# EAGLE schematic axiom_beta_sensor_cmv12000_v0.14_tht.d1d1087f (EAGLE 7.7.0)

## Sheet 1 of 4
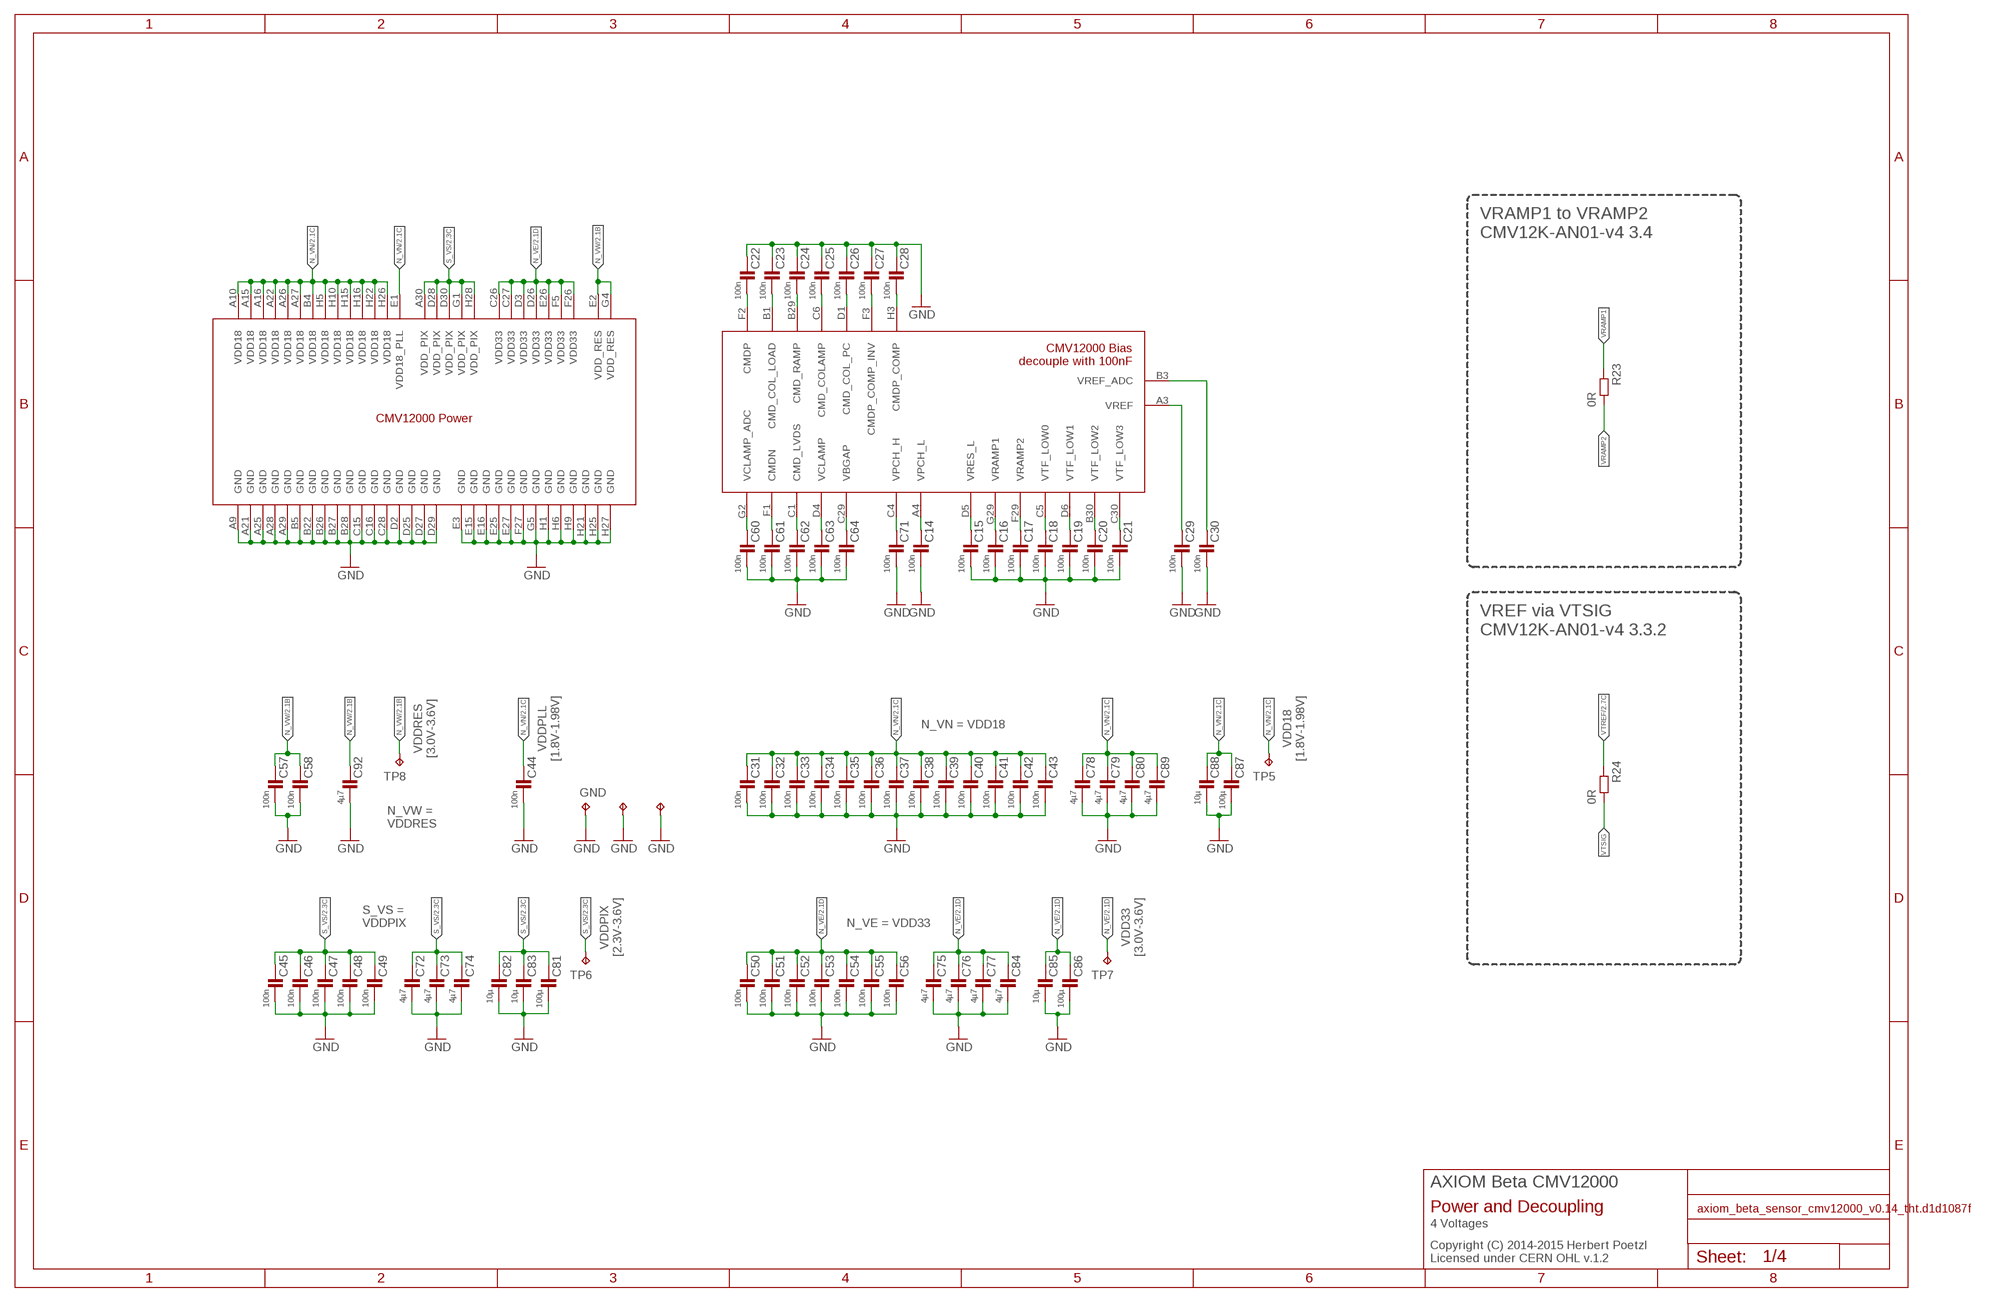
[diagram p0: schematic, sheet 1]

### Parts
C14  100n  C0402-C  [0402-C]
C15  100n  C0402-C  [0402-C]
C16  100n  C0402-C  [0402-C]
C17  100n  C0402-C  [0402-C]
C18  100n  C0402-C  [0402-C]
C19  100n  C0402-C  [0402-C]
C20  100n  C0402-C  [0402-C]
C21  100n  C0402-C  [0402-C]
C22  100n  C0402-C  [0402-C]
C23  100n  C0402-C  [0402-C]
C24  100n  C0402-C  [0402-C]
C25  100n  C0402-C  [0402-C]
C26  100n  C0402-C  [0402-C]
C27  100n  C0402-C  [0402-C]
C28  100n  C0402-C  [0402-C]
C29  100n  C0402-C  [0402-C]
C30  100n  C0402-C  [0402-C]
C31  100n  C0402-C  [0402-C]
C32  100n  C0402-C  [0402-C]
C33  100n  C0402-C  [0402-C]
C34  100n  C0402-C  [0402-C]
C35  100n  C0402-C  [0402-C]
C36  100n  C0402-C  [0402-C]
C37  100n  C0402-C  [0402-C]
C38  100n  C0402-C  [0402-C]
C39  100n  C0402-C  [0402-C]
C40  100n  C0402-C  [0402-C]
C41  100n  C0402-C  [0402-C]
C42  100n  C0402-C  [0402-C]
C43  100n  C0402-C  [0402-C]
C44  100n  C0402-C  [0402-C]
C45  100n  C0402-C  [0402-C]
C46  100n  C0402-C  [0402-C]
C47  100n  C0402-C  [0402-C]
C48  100n  C0402-C  [0402-C]
C49  100n  C0402-C  [0402-C]
C50  100n  C0402-C  [0402-C]
C51  100n  C0402-C  [0402-C]
C52  100n  C0402-C  [0402-C]
C53  100n  C0402-C  [0402-C]
C54  100n  C0402-C  [0402-C]
C55  100n  C0402-C  [0402-C]
C56  100n  C0402-C  [0402-C]
C57  100n  C0402-C  [0402-C]
C58  100n  C0402-C  [0402-C]
C60  100n  C0402-C  [0402-C]
C61  100n  C0402-C  [0402-C]
C62  100n  C0402-C  [0402-C]
C63  100n  C0402-C  [0402-C]
C64  100n  C0402-C  [0402-C]
C71  100n  C0402-C  [0402-C]
C72  4µ7  C0402-B  [0402-B]
C73  4µ7  C0402-C  [0402-C]
C74  4µ7  C0402-C  [0402-C]
C75  4µ7  C0402-C  [0402-C]
C76  4µ7  C0402-C  [0402-C]
C77  4µ7  C0402-B  [0402-B]
C78  4µ7  C0402-B  [0402-B]
C79  4µ7  C0402-C  [0402-C]
C80  4µ7  C0402-C  [0402-C]
C81  100µ  C1206-B  [1206-B]
C82  10µ  C0603-C  [0603-C]
C83  10µ  C0603-C  [0603-C]
C84  4µ7  C0402-C  [0402-C]
C85  10µ  C0603-C  [0603-C]
C86  100µ  C1206-B  [1206-B]
C87  100µ  C1206-B  [1206-B]
C88  10µ  C0603-C  [0603-C]
C89  4µ7  C0402-C  [0402-C]
C92  4µ7  C0402-C  [0402-C]
GND  TPTP10R  [TP10R]
GND75  TPTP10R  [TP10R]
GND77  TPTP10R  [TP10R]
R23  0R  R0402-C  [0402-C]
R24  0R  R0402-C  [0402-C]
SENSOR  CMV12000ANDON  [10-30-07-237-400T4]
TP5  TPTP10R  [TP10R]
TP6  TPTP10R  [TP10R]
TP7  TPTP10R  [TP10R]
TP8  TPTP10R  [TP10R]

### Nets
GND: C14.2 C15.2 C16.2 C17.2 C18.2 C19.2 C20.2 C21.2 C22.1 C23.1 C24.1 C25.1 C26.1 C27.1 C28.1 C29.2 C30.2 C31.2 C32.2 C33.2 C34.2 C35.2 C36.2 C37.2 C38.2 C39.2 C40.2 C41.2 C42.2 C43.2 C44.2 C45.2 C46.2 C47.2 C48.2 C49.2 C50.2 C51.2 C52.2 C53.2 C54.2 C55.2 C56.2 C57.2 C58.2 C60.2 C61.2 C62.2 C63.2 C64.2 C71.2 C72.2 C73.2 C74.2 C75.2 C76.2 C77.2 C78.2 C79.2 C80.2 C81.2 C82.2 C83.2 C84.2 C85.2 C86.2 C87.2 C88.2 C89.2 C92.2 GND75.TP GND77.TP GND.TP SENSOR.A9(GND) SENSOR.A21(GND) SENSOR.A25(GND) SENSOR.A28(GND) SENSOR.A29(GND) SENSOR.B5(GND) SENSOR.B22(GND) SENSOR.B26(GND) SENSOR.B27(GND) SENSOR.B28(GND) SENSOR.C15(GND) SENSOR.C16(GND) SENSOR.C28(GND) SENSOR.D2(GND) SENSOR.D25(GND) SENSOR.D27(GND) SENSOR.D29(GND) SENSOR.E3(GND) SENSOR.E15(GND) SENSOR.E16(GND) SENSOR.E25(GND) SENSOR.E27(GND) SENSOR.F27(GND) SENSOR.G5(GND) SENSOR.H1(GND) SENSOR.H6(GND) SENSOR.H9(GND) SENSOR.H21(GND) SENSOR.H25(GND) SENSOR.H27(GND) ; also sheet 2,3,4
N$5: C60.1 SENSOR.G2(VCLAMP_ADC)
N$6: C61.1 SENSOR.F1(CMDN)
N$11: C62.1 SENSOR.C1(CMD_LVDS)
N$12: C63.1 SENSOR.D4(VCLAMP)
N$15: C64.1 SENSOR.C29(VBGAP)
N$16: C71.1 SENSOR.C4(VPCH_H)
N$17: C14.1 SENSOR.A4(VPCH_L)
N$18: C15.1 SENSOR.D5(VRES_L)
N$21: C18.1 SENSOR.C5(VTF_LOW0)
N$22: C19.1 SENSOR.D6(VTF_LOW1)
N$23: C20.1 SENSOR.B30(VTF_LOW2)
N$24: C21.1 SENSOR.C30(VTF_LOW3)
N$25: C22.2 SENSOR.F2(CMDP)
N$26: C23.2 SENSOR.B1(CMD_COL_LOAD)
N$27: C24.2 SENSOR.B29(CMD_RAMP)
N$28: C25.2 SENSOR.C6(CMD_COLAMP)
N$29: C26.2 SENSOR.D1(CMD_COL_PC)
N$30: C27.2 SENSOR.F3(CMDP_COMP_INV)
N$31: C28.2 SENSOR.H3(CMDP_COMP)
N$32: C29.1 SENSOR.A3(VREF)
N$33: C30.1 SENSOR.B3(VREF_ADC)
N_VE: C50.1 C51.1 C52.1 C53.1 C54.1 C55.1 C56.1 C75.1 C76.1 C77.1 C84.1 C85.1 C86.1 SENSOR.C26(VDD33) SENSOR.C27(VDD33) SENSOR.D3(VDD33) SENSOR.D26(VDD33) SENSOR.E26(VDD33) SENSOR.F5(VDD33) SENSOR.F26(VDD33) TP7.TP ; also sheet 2,4
N_VN: C31.1 C32.1 C33.1 C34.1 C35.1 C36.1 C37.1 C38.1 C39.1 C40.1 C41.1 C42.1 C43.1 C44.1 C78.1 C79.1 C80.1 C87.1 C88.1 C89.1 SENSOR.A10(VDD18) SENSOR.A15(VDD18) SENSOR.A16(VDD18) SENSOR.A22(VDD18) SENSOR.A26(VDD18) SENSOR.A27(VDD18) SENSOR.B4(VDD18) SENSOR.E1(VDD18_PLL) SENSOR.H5(VDD18) SENSOR.H10(VDD18) SENSOR.H15(VDD18) SENSOR.H16(VDD18) SENSOR.H22(VDD18) SENSOR.H26(VDD18) TP5.TP ; also sheet 2,4
N_VW: C57.1 C58.1 C92.1 SENSOR.E2(VDD_RES) SENSOR.G4(VDD_RES) TP8.TP ; also sheet 2
S_VS: C45.1 C46.1 C47.1 C48.1 C49.1 C72.1 C73.1 C74.1 C81.1 C82.1 C83.1 SENSOR.A30(VDD_PIX) SENSOR.D28(VDD_PIX) SENSOR.D30(VDD_PIX) SENSOR.G1(VDD_PIX) SENSOR.H28(VDD_PIX) TP6.TP ; also sheet 2
VRAMP1: C16.1 R23.1 SENSOR.G29(VRAMP1)
VRAMP2: C17.1 R23.2 SENSOR.F29(VRAMP2)
VTREF: R24.1 ; also sheet 2,4
VTSIG: R24.2 ; also sheet 4
Unconnected: SENSOR.C3(NC) SENSOR.F24(NC) SENSOR.F25(NC) SENSOR.H2(NC)

### Notes on the sheet
- VRAMP1 to VRAMP2
  CMV12K-AN01-v4 3.4
- VREF via VTSIG
  CMV12K-AN01-v4 3.3.2
- VDDRES
  [3.0V-3.6V]
- VDDPLL
  [1.8V-1.98V]
- N_VN = VDD18
- VDD18
  [1.8V-1.98V]
- N_VW =
  VDDRES
- S_VS =
  VDDPIX
- VDDPIX
  [2.3V-3.6V]
- N_VE = VDD33
- VDD33
  [3.0V-3.6V]
- AXIOM Beta CMV12000
- Power and Decoupling
- 4 Voltages
- Copyright (C) 2014-2015 Herbert Poetzl
  Licensed under CERN OHL v.1.2

## Sheet 2 of 4
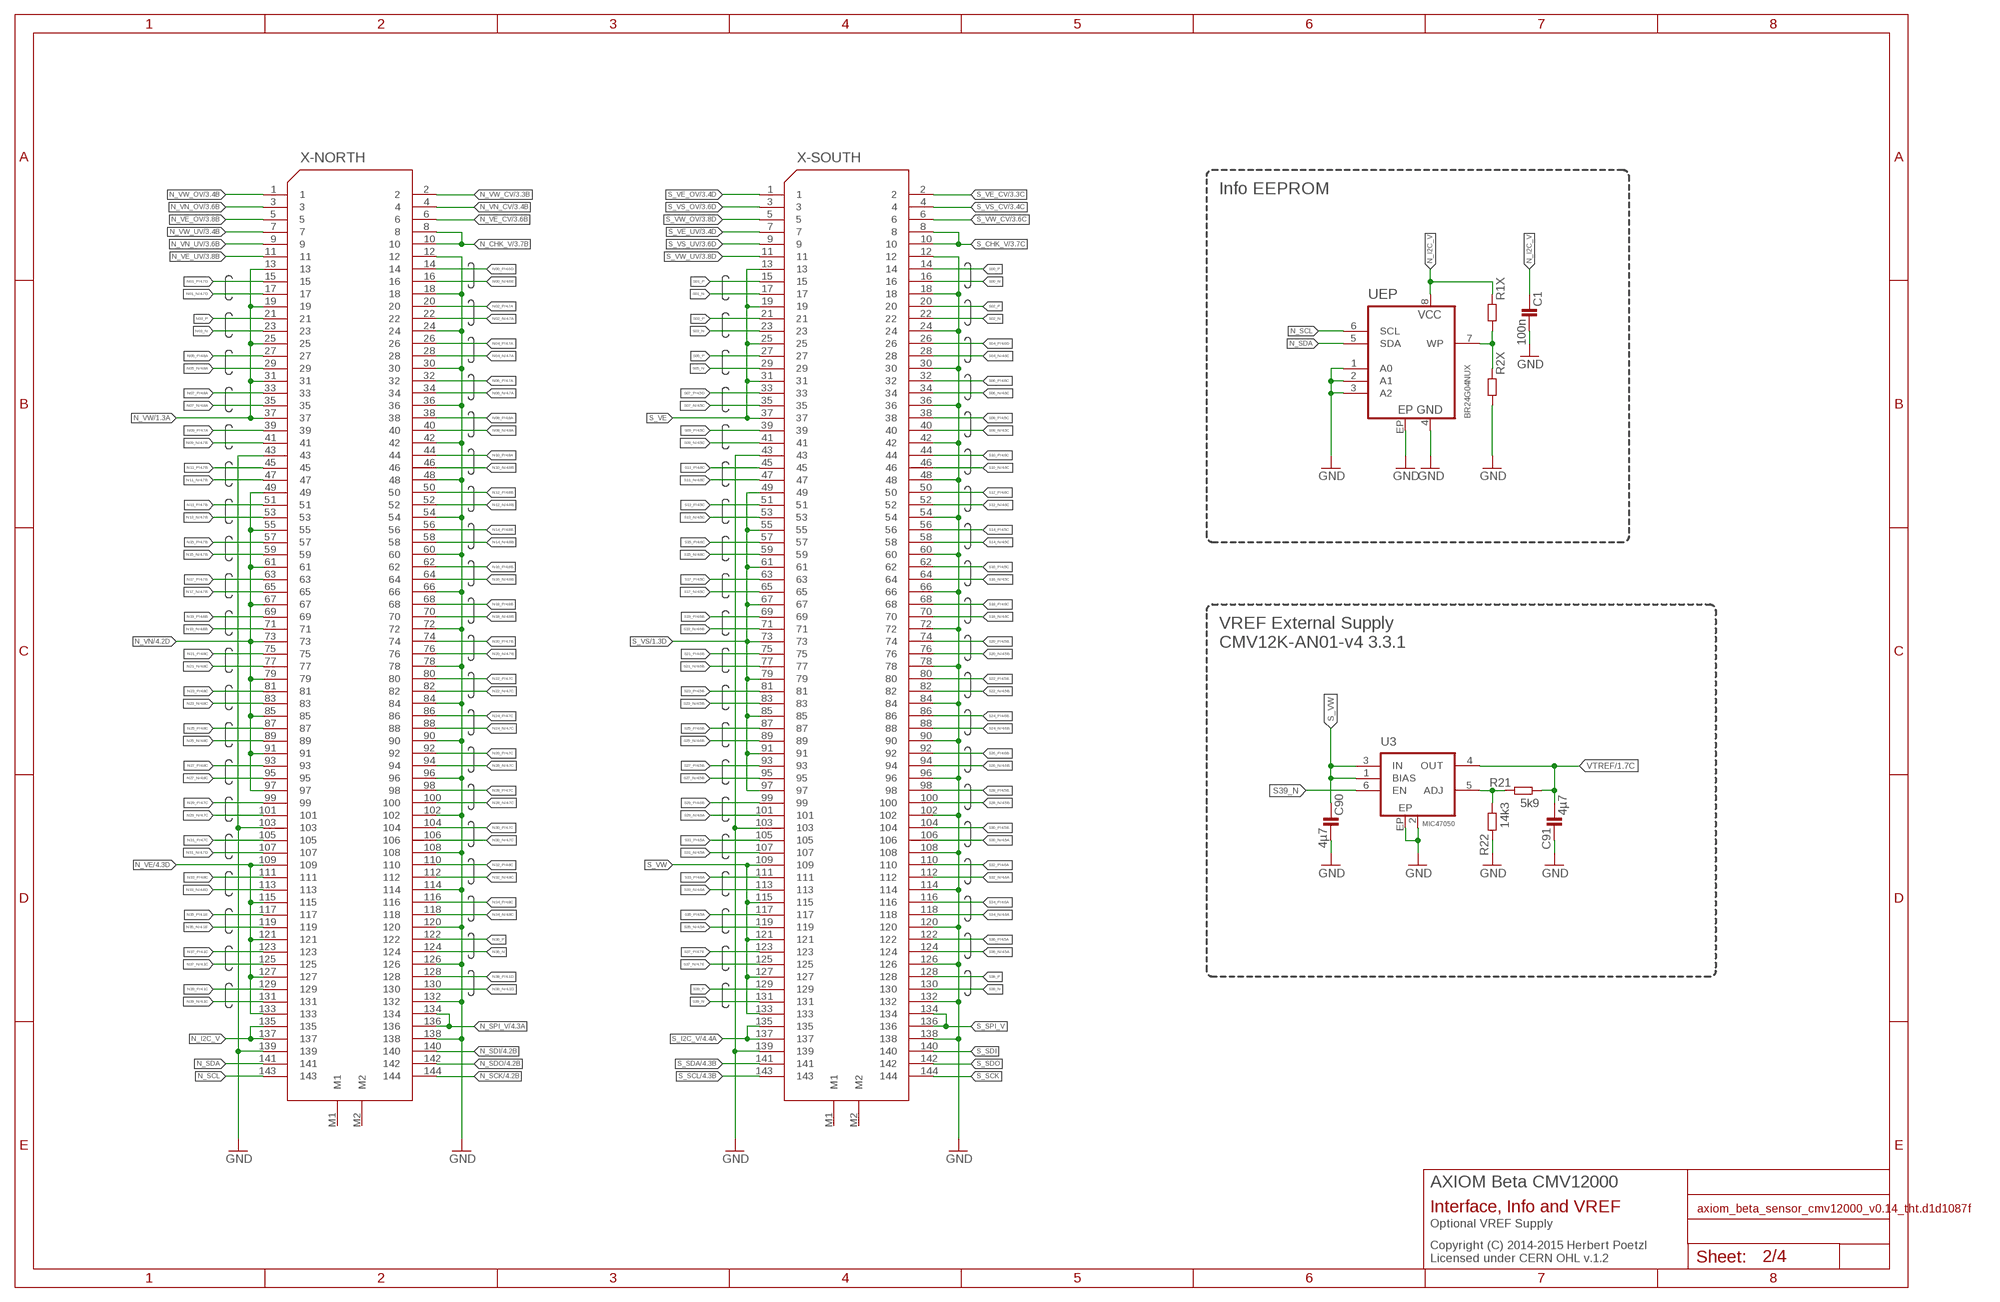
[diagram p1: schematic, sheet 2]

### Parts
C1  100n  C0402-C  [0402-C]
C90  4µ7  C0402-C  [0402-C]
C91  4µ7  C0402-C  [0402-C]
R1X  R0402-C  [0402-C]
R2X  R0402-C  [0402-C]
R21  5k9  R0402-C  [0402-C]
R22  14k3  R0402-C  [0402-C]
U3  MIC47050  MIC47050-ADJ  [MLF-6]
UEP  BR24G04NUX  [DFN200X300X100-9N]
X-NORTH  FX10-144P  [FX10A-144P]
X-SOUTH  FX10-144P  [FX10A-144P]

### Nets
GND: C1.2 C90.2 C91.1 R2X.2 R22.1 U3.2(GND) U3.EP UEP.1(A0) UEP.2(A1) UEP.3(A2) UEP.4(GND) UEP.EP X-NORTH.12 X-NORTH.18 X-NORTH.24 X-NORTH.30 X-NORTH.36 X-NORTH.42 X-NORTH.43 X-NORTH.48 X-NORTH.54 X-NORTH.60 X-NORTH.66 X-NORTH.72 X-NORTH.78 X-NORTH.84 X-NORTH.90 X-NORTH.96 X-NORTH.102 X-NORTH.103 X-NORTH.108 X-NORTH.114 X-NORTH.120 X-NORTH.126 X-NORTH.132 X-NORTH.138 X-NORTH.139 X-SOUTH.12 X-SOUTH.18 X-SOUTH.24 X-SOUTH.30 X-SOUTH.36 X-SOUTH.42 X-SOUTH.43 X-SOUTH.48 X-SOUTH.54 X-SOUTH.60 X-SOUTH.66 X-SOUTH.72 X-SOUTH.78 X-SOUTH.84 X-SOUTH.90 X-SOUTH.96 X-SOUTH.102 X-SOUTH.103 X-SOUTH.108 X-SOUTH.114 X-SOUTH.120 X-SOUTH.126 X-SOUTH.132 X-SOUTH.138 X-SOUTH.139 ; also sheet 1,3,4
N00_N: X-NORTH.16 ; also sheet 4
N00_P: X-NORTH.14 ; also sheet 4
N01_N: X-NORTH.17 ; also sheet 4
N01_P: X-NORTH.15 ; also sheet 4
N02_N: X-NORTH.22 ; also sheet 4
N02_P: X-NORTH.20 ; also sheet 4
N03_N: X-NORTH.23
N03_P: X-NORTH.21
N04_N: X-NORTH.28 ; also sheet 4
N04_P: X-NORTH.26 ; also sheet 4
N05_N: X-NORTH.29 ; also sheet 4
N05_P: X-NORTH.27 ; also sheet 4
N06_N: X-NORTH.34 ; also sheet 4
N06_P: X-NORTH.32 ; also sheet 4
N07_N: X-NORTH.35 ; also sheet 4
N07_P: X-NORTH.33 ; also sheet 4
N08_N: X-NORTH.40 ; also sheet 4
N08_P: X-NORTH.38 ; also sheet 4
N09_N: X-NORTH.41 ; also sheet 4
N09_P: X-NORTH.39 ; also sheet 4
N10_N: X-NORTH.46 ; also sheet 4
N10_P: X-NORTH.44 ; also sheet 4
N11_N: X-NORTH.47 ; also sheet 4
N11_P: X-NORTH.45 ; also sheet 4
N12_N: X-NORTH.52 ; also sheet 4
N12_P: X-NORTH.50 ; also sheet 4
N13_N: X-NORTH.53 ; also sheet 4
N13_P: X-NORTH.51 ; also sheet 4
N14_N: X-NORTH.58 ; also sheet 4
N14_P: X-NORTH.56 ; also sheet 4
N15_N: X-NORTH.59 ; also sheet 4
N15_P: X-NORTH.57 ; also sheet 4
N16_N: X-NORTH.64 ; also sheet 4
N16_P: X-NORTH.62 ; also sheet 4
N17_N: X-NORTH.65 ; also sheet 4
N17_P: X-NORTH.63 ; also sheet 4
N18_N: X-NORTH.70 ; also sheet 4
N18_P: X-NORTH.68 ; also sheet 4
N19_N: X-NORTH.71 ; also sheet 4
N19_P: X-NORTH.69 ; also sheet 4
N20_N: X-NORTH.76 ; also sheet 4
N20_P: X-NORTH.74 ; also sheet 4
N21_N: X-NORTH.77 ; also sheet 4
N21_P: X-NORTH.75 ; also sheet 4
N22_N: X-NORTH.82 ; also sheet 4
N22_P: X-NORTH.80 ; also sheet 4
N23_N: X-NORTH.83 ; also sheet 4
N23_P: X-NORTH.81 ; also sheet 4
N24_N: X-NORTH.88 ; also sheet 4
N24_P: X-NORTH.86 ; also sheet 4
N25_N: X-NORTH.89 ; also sheet 4
N25_P: X-NORTH.87 ; also sheet 4
N26_N: X-NORTH.94 ; also sheet 4
N26_P: X-NORTH.92 ; also sheet 4
N27_N: X-NORTH.95 ; also sheet 4
N27_P: X-NORTH.93 ; also sheet 4
N28_N: X-NORTH.100 ; also sheet 4
N28_P: X-NORTH.98 ; also sheet 4
N29_N: X-NORTH.101 ; also sheet 4
N29_P: X-NORTH.99 ; also sheet 4
N30_N: X-NORTH.106 ; also sheet 4
N30_P: X-NORTH.104 ; also sheet 4
N31_N: X-NORTH.107 ; also sheet 4
N31_P: X-NORTH.105 ; also sheet 4
N32_N: X-NORTH.112 ; also sheet 4
N32_P: X-NORTH.110 ; also sheet 4
N33_N: X-NORTH.113 ; also sheet 4
N33_P: X-NORTH.111 ; also sheet 4
N34_N: X-NORTH.118 ; also sheet 4
N34_P: X-NORTH.116 ; also sheet 4
N35_N: X-NORTH.119 ; also sheet 4
N35_P: X-NORTH.117 ; also sheet 4
N36_N: X-NORTH.124
N36_P: X-NORTH.122
N37_N: X-NORTH.125 ; also sheet 4
N37_P: X-NORTH.123 ; also sheet 4
N38_N: X-NORTH.130 ; also sheet 4
N38_P: X-NORTH.128 ; also sheet 4
N39_N: X-NORTH.131 ; also sheet 4
N39_P: X-NORTH.129 ; also sheet 4
N$1: R1X.2 R2X.1 UEP.7(WP)
N$19: R21.1 R22.2 U3.5(ADJ)
N_CHK_V: X-NORTH.8 X-NORTH.10 ; also sheet 3
N_I2C_V: C1.1 R1X.1 UEP.8(VCC) X-NORTH.135 X-NORTH.137
N_SCK: X-NORTH.144 ; also sheet 4
N_SCL: UEP.6(SCL) X-NORTH.143
N_SDA: UEP.5(SDA) X-NORTH.141
N_SDI: X-NORTH.140 ; also sheet 4
N_SDO: X-NORTH.142 ; also sheet 4
N_SPI_V: X-NORTH.134 X-NORTH.136 ; also sheet 4
N_VE: X-NORTH.109 X-NORTH.115 X-NORTH.121 X-NORTH.127 X-NORTH.133 ; also sheet 1,4
N_VE_CV: X-NORTH.6 ; also sheet 3
N_VE_OV: X-NORTH.5 ; also sheet 3
N_VE_UV: X-NORTH.11 ; also sheet 3
N_VN: X-NORTH.49 X-NORTH.55 X-NORTH.61 X-NORTH.67 X-NORTH.73 X-NORTH.79 X-NORTH.85 X-NORTH.91 X-NORTH.97 ; also sheet 1,4
N_VN_CV: X-NORTH.4 ; also sheet 3
N_VN_OV: X-NORTH.3 ; also sheet 3
N_VN_UV: X-NORTH.9 ; also sheet 3
N_VW: X-NORTH.13 X-NORTH.19 X-NORTH.25 X-NORTH.31 X-NORTH.37 ; also sheet 1
N_VW_CV: X-NORTH.2 ; also sheet 3
N_VW_OV: X-NORTH.1 ; also sheet 3
N_VW_UV: X-NORTH.7 ; also sheet 3
S00_N: X-SOUTH.16
S00_P: X-SOUTH.14
S01_N: X-SOUTH.17
S01_P: X-SOUTH.15
S02_N: X-SOUTH.22
S02_P: X-SOUTH.20
S03_N: X-SOUTH.23
S03_P: X-SOUTH.21
S04_N: X-SOUTH.28 ; also sheet 4
S04_P: X-SOUTH.26 ; also sheet 4
S05_N: X-SOUTH.29
S05_P: X-SOUTH.27
S06_N: X-SOUTH.34 ; also sheet 4
S06_P: X-SOUTH.32 ; also sheet 4
S07_N: X-SOUTH.35 ; also sheet 4
S07_P: X-SOUTH.33 ; also sheet 4
S08_N: X-SOUTH.40 ; also sheet 4
S08_P: X-SOUTH.38 ; also sheet 4
S09_N: X-SOUTH.41 ; also sheet 4
S09_P: X-SOUTH.39 ; also sheet 4
S10_N: X-SOUTH.46 ; also sheet 4
S10_P: X-SOUTH.44 ; also sheet 4
S11_N: X-SOUTH.47 ; also sheet 4
S11_P: X-SOUTH.45 ; also sheet 4
S12_N: X-SOUTH.52 ; also sheet 4
S12_P: X-SOUTH.50 ; also sheet 4
S13_N: X-SOUTH.53 ; also sheet 4
S13_P: X-SOUTH.51 ; also sheet 4
S14_N: X-SOUTH.58 ; also sheet 4
S14_P: X-SOUTH.56 ; also sheet 4
S15_N: X-SOUTH.59 ; also sheet 4
S15_P: X-SOUTH.57 ; also sheet 4
S16_N: X-SOUTH.64 ; also sheet 4
S16_P: X-SOUTH.62 ; also sheet 4
S17_N: X-SOUTH.65 ; also sheet 4
S17_P: X-SOUTH.63 ; also sheet 4
S18_N: X-SOUTH.70 ; also sheet 4
S18_P: X-SOUTH.68 ; also sheet 4
S19_N: X-SOUTH.71 ; also sheet 4
S19_P: X-SOUTH.69 ; also sheet 4
S20_N: X-SOUTH.76 ; also sheet 4
S20_P: X-SOUTH.74 ; also sheet 4
S21_N: X-SOUTH.77 ; also sheet 4
S21_P: X-SOUTH.75 ; also sheet 4
S22_N: X-SOUTH.82 ; also sheet 4
S22_P: X-SOUTH.80 ; also sheet 4
S23_N: X-SOUTH.83 ; also sheet 4
S23_P: X-SOUTH.81 ; also sheet 4
S24_N: X-SOUTH.88 ; also sheet 4
S24_P: X-SOUTH.86 ; also sheet 4
S25_N: X-SOUTH.89 ; also sheet 4
S25_P: X-SOUTH.87 ; also sheet 4
S26_N: X-SOUTH.94 ; also sheet 4
S26_P: X-SOUTH.92 ; also sheet 4
S27_N: X-SOUTH.95 ; also sheet 4
S27_P: X-SOUTH.93 ; also sheet 4
S28_N: X-SOUTH.100 ; also sheet 4
S28_P: X-SOUTH.98 ; also sheet 4
S29_N: X-SOUTH.101 ; also sheet 4
S29_P: X-SOUTH.99 ; also sheet 4
S30_N: X-SOUTH.106 ; also sheet 4
S30_P: X-SOUTH.104 ; also sheet 4
S31_N: X-SOUTH.107 ; also sheet 4
S31_P: X-SOUTH.105 ; also sheet 4
S32_N: X-SOUTH.112 ; also sheet 4
S32_P: X-SOUTH.110 ; also sheet 4
S33_N: X-SOUTH.113 ; also sheet 4
S33_P: X-SOUTH.111 ; also sheet 4
S34_N: X-SOUTH.118 ; also sheet 4
S34_P: X-SOUTH.116 ; also sheet 4
S35_N: X-SOUTH.119 ; also sheet 4
S35_P: X-SOUTH.117 ; also sheet 4
S36_N: X-SOUTH.124 ; also sheet 4
S36_P: X-SOUTH.122 ; also sheet 4
S37_N: X-SOUTH.125 ; also sheet 4
S37_P: X-SOUTH.123 ; also sheet 4
S38_N: X-SOUTH.130
S38_P: X-SOUTH.128
S39_N: U3.6(EN) X-SOUTH.131
S39_P: X-SOUTH.129
S_CHK_V: X-SOUTH.8 X-SOUTH.10 ; also sheet 3
S_I2C_V: X-SOUTH.135 X-SOUTH.137 ; also sheet 4
S_SCK: X-SOUTH.144
S_SCL: X-SOUTH.143 ; also sheet 4
S_SDA: X-SOUTH.141 ; also sheet 4
S_SDI: X-SOUTH.140
S_SDO: X-SOUTH.142
S_SPI_V: X-SOUTH.134 X-SOUTH.136
S_VE: X-SOUTH.13 X-SOUTH.19 X-SOUTH.25 X-SOUTH.31 X-SOUTH.37
S_VE_CV: X-SOUTH.2 ; also sheet 3
S_VE_OV: X-SOUTH.1 ; also sheet 3
S_VE_UV: X-SOUTH.7 ; also sheet 3
S_VS: X-SOUTH.49 X-SOUTH.55 X-SOUTH.61 X-SOUTH.67 X-SOUTH.73 X-SOUTH.79 X-SOUTH.85 X-SOUTH.91 X-SOUTH.97 ; also sheet 1
S_VS_CV: X-SOUTH.4 ; also sheet 3
S_VS_OV: X-SOUTH.3 ; also sheet 3
S_VS_UV: X-SOUTH.9 ; also sheet 3
S_VW: C90.1 U3.1(BIAS) U3.3(IN) X-SOUTH.109 X-SOUTH.115 X-SOUTH.121 X-SOUTH.127 X-SOUTH.133
S_VW_CV: X-SOUTH.6 ; also sheet 3
S_VW_OV: X-SOUTH.5 ; also sheet 3
S_VW_UV: X-SOUTH.11 ; also sheet 3
VTREF: C91.2 R21.2 U3.4(OUT) ; also sheet 1,4
Unconnected: X-NORTH.M1 X-NORTH.M2 X-SOUTH.M1 X-SOUTH.M2

### Notes on the sheet
- Info EEPROM
- VREF External Supply
  CMV12K-AN01-v4 3.3.1
- AXIOM Beta CMV12000
- Interface, Info and VREF
- Optional VREF Supply
- Copyright (C) 2014-2015 Herbert Poetzl
  Licensed under CERN OHL v.1.2

## Sheet 3 of 4
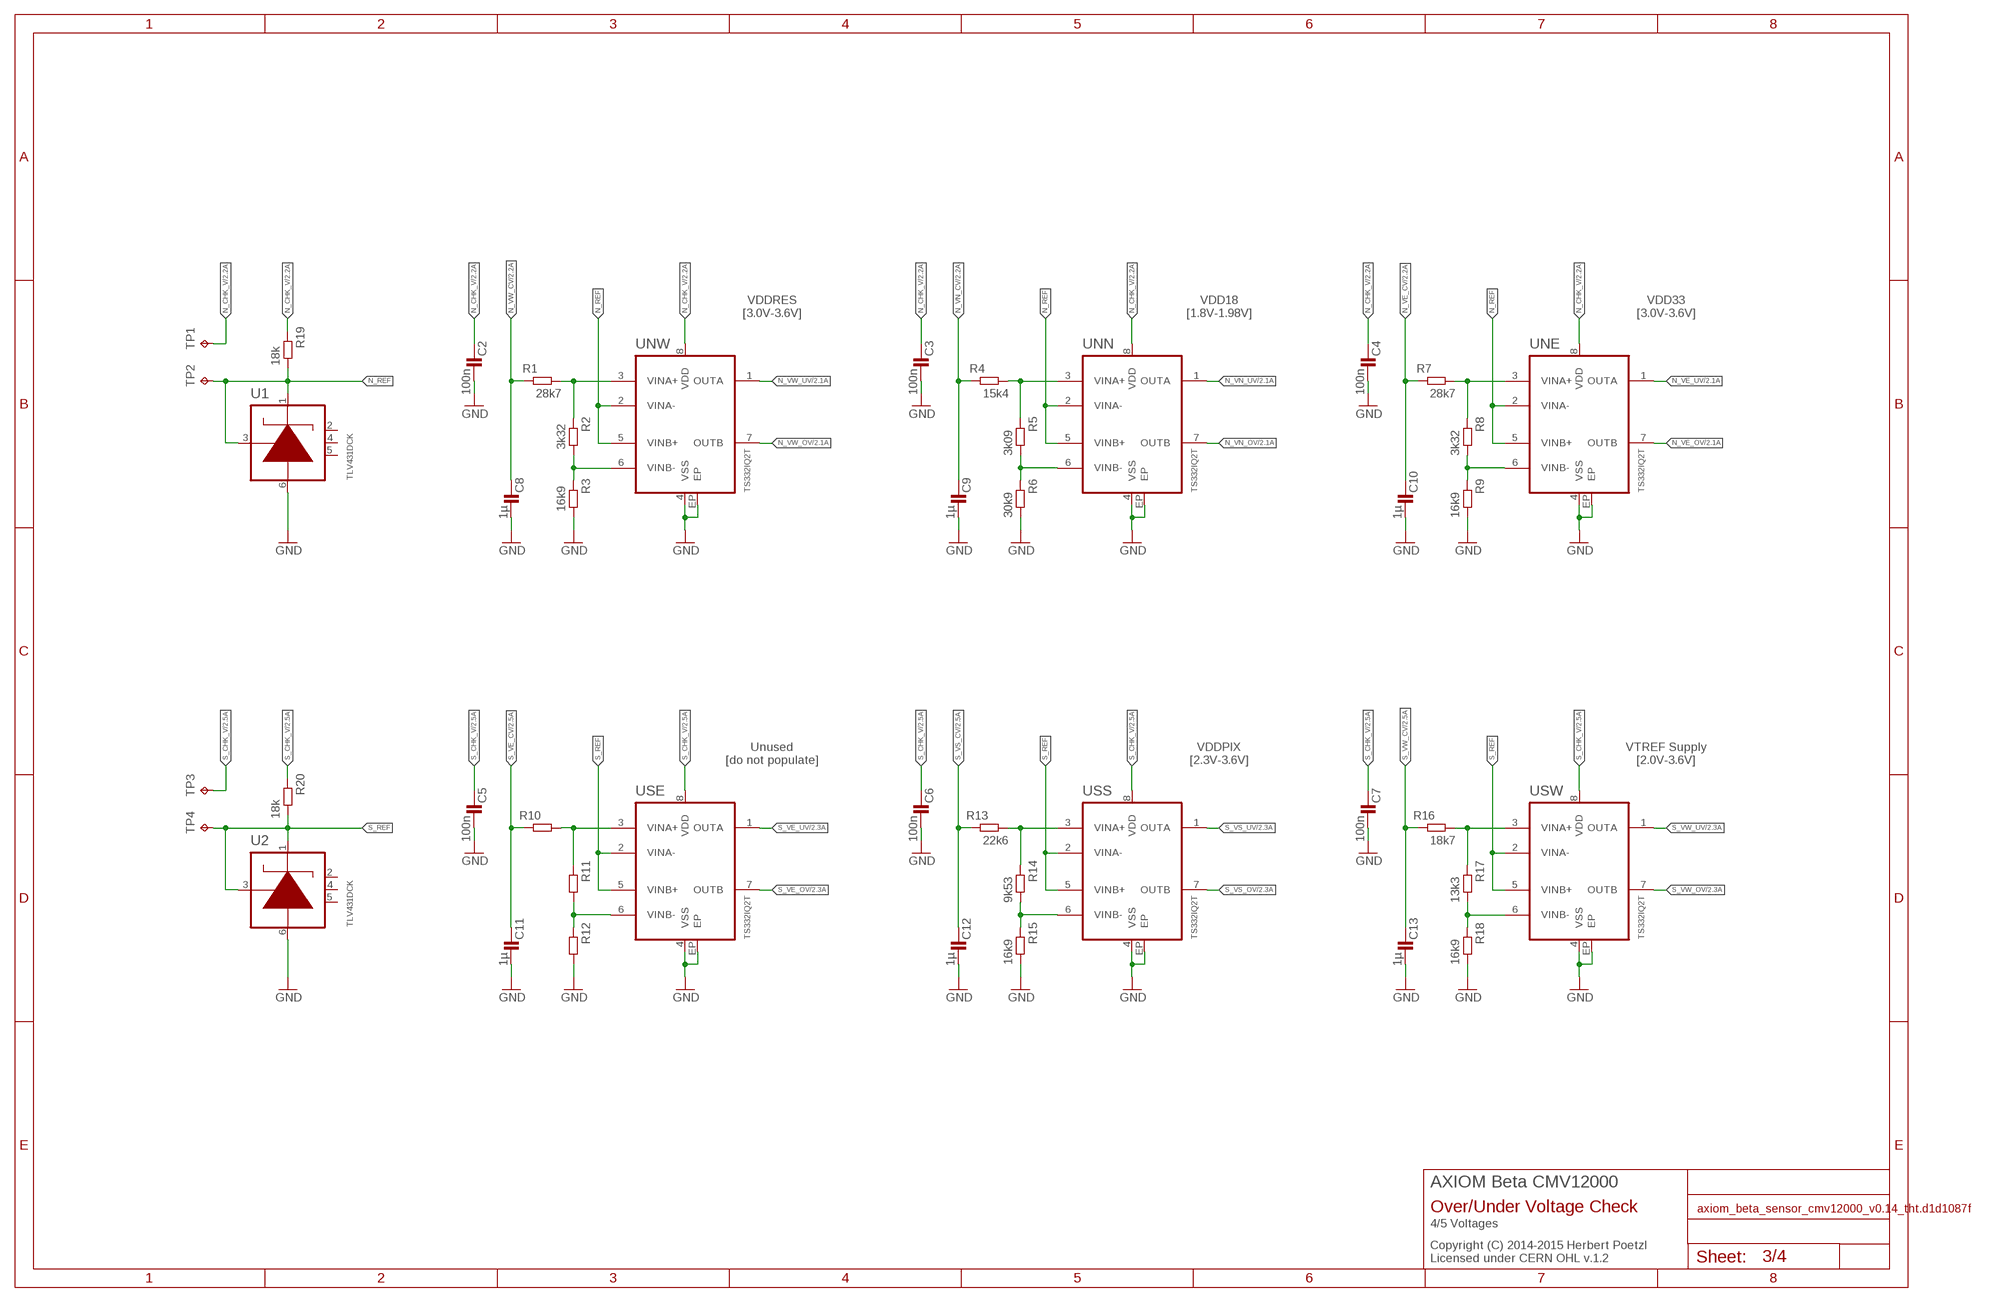
[diagram p2: schematic, sheet 3]

### Parts
C2  100n  C0402-C  [0402-C]
C3  100n  C0402-C  [0402-C]
C4  100n  C0402-C  [0402-C]
C5  100n  C0402-C  [0402-C]
C6  100n  C0402-C  [0402-C]
C7  100n  C0402-C  [0402-C]
C8  1µ  C0402-C  [0402-C]
C9  1µ  C0402-C  [0402-C]
C10  1µ  C0402-C  [0402-C]
C11  1µ  C0402-C  [0402-C]
C12  1µ  C0402-C  [0402-C]
C13  1µ  C0402-C  [0402-C]
R1  28k7  R0402-C  [0402-C]
R2  3k32  R0402-C  [0402-C]
R3  16k9  R0402-C  [0402-C]
R4  15k4  R0402-C  [0402-C]
R5  3k09  R0402-C  [0402-C]
R6  30k9  R0402-C  [0402-C]
R7  28k7  R0402-C  [0402-C]
R8  3k32  R0402-C  [0402-C]
R9  16k9  R0402-C  [0402-C]
R10  R0402-C  [0402-C]
R11  R0402-C  [0402-C]
R12  R0402-C  [0402-C]
R13  22k6  R0402-C  [0402-C]
R14  9k53  R0402-C  [0402-C]
R15  16k9  R0402-C  [0402-C]
R16  18k7  R0402-C  [0402-C]
R17  13k3  R0402-C  [0402-C]
R18  16k9  R0402-C  [0402-C]
R19  18k  R0402-C  [0402-C]
R20  18k  R0402-C  [0402-C]
TP1  TPTP10R  [TP10R]
TP2  TPTP10R  [TP10R]
TP3  TPTP10R  [TP10R]
TP4  TPTP10R  [TP10R]
U1  TLV431DCK  [SOT65P210X110-6N]
U2  TLV431DCK  [SOT65P210X110-6N]
UNE  TS332IQ2T  [DFN200X200X100-9N]
UNN  TS332IQ2T  [DFN200X200X100-9N]
UNW  TS332IQ2T  [DFN200X200X100-9N]
USE  TS332IQ2T  [DFN200X200X100-9N]
USS  TS332IQ2T  [DFN200X200X100-9N]
USW  TS332IQ2T  [DFN200X200X100-9N]

### Nets
GND: C2.2 C3.2 C4.2 C5.2 C6.2 C7.2 C8.2 C9.2 C10.2 C11.2 C12.2 C13.2 R3.2 R6.2 R9.2 R12.2 R15.2 R18.2 U1.6(ANODE) U2.6(ANODE) UNE.4(VSS) UNE.EP UNN.4(VSS) UNN.EP UNW.4(VSS) UNW.EP USE.4(VSS) USE.EP USS.4(VSS) USS.EP USW.4(VSS) USW.EP ; also sheet 1,2,4
N$172: R11.2 R12.1 USE.6(VINB-)
N$173: R5.2 R6.1 UNN.6(VINB-)
N$182: R8.2 R9.1 UNE.6(VINB-)
N$183: R10.2 R11.1 USE.3(VINA+)
N$188: R7.2 R8.1 UNE.3(VINA+)
N$191: R1.2 R2.1 UNW.3(VINA+)
N$192: R2.2 R3.1 UNW.6(VINB-)
N$193: R14.2 R15.1 USS.6(VINB-)
N$194: R13.2 R14.1 USS.3(VINA+)
N$195: R16.2 R17.1 USW.3(VINA+)
N$196: R17.2 R18.1 USW.6(VINB-)
N_CHK_V: C2.1 C3.1 C4.1 R19.1 TP1.TP UNE.8(VDD) UNN.8(VDD) UNW.8(VDD) ; also sheet 2
N_REF: R19.2 TP2.TP U1.1(CATHODE) U1.3(REF) UNE.2(VINA-) UNE.5(VINB+) UNN.2(VINA-) UNN.5(VINB+) UNW.2(VINA-) UNW.5(VINB+)
N_VE_CV: C10.1 R7.1 ; also sheet 2
N_VE_OV: UNE.7(OUTB) ; also sheet 2
N_VE_UV: UNE.1(OUTA) ; also sheet 2
N_VN_CV: C9.1 R4.1 ; also sheet 2
N_VN_OV: UNN.7(OUTB) ; also sheet 2
N_VN_UV: UNN.1(OUTA) ; also sheet 2
N_VW_CV: C8.1 R1.1 ; also sheet 2
N_VW_OV: UNW.7(OUTB) ; also sheet 2
N_VW_UV: UNW.1(OUTA) ; also sheet 2
R5: R4.2 R5.1 UNN.3(VINA+)
S_CHK_V: C5.1 C6.1 C7.1 R20.1 TP3.TP USE.8(VDD) USS.8(VDD) USW.8(VDD) ; also sheet 2
S_REF: R20.2 TP4.TP U2.1(CATHODE) U2.3(REF) USE.2(VINA-) USE.5(VINB+) USS.2(VINA-) USS.5(VINB+) USW.2(VINA-) USW.5(VINB+)
S_VE_CV: C11.1 R10.1 ; also sheet 2
S_VE_OV: USE.7(OUTB) ; also sheet 2
S_VE_UV: USE.1(OUTA) ; also sheet 2
S_VS_CV: C12.1 R13.1 ; also sheet 2
S_VS_OV: USS.7(OUTB) ; also sheet 2
S_VS_UV: USS.1(OUTA) ; also sheet 2
S_VW_CV: C13.1 R16.1 ; also sheet 2
S_VW_OV: USW.7(OUTB) ; also sheet 2
S_VW_UV: USW.1(OUTA) ; also sheet 2
Unconnected: U1.2(NC) U1.4(NC) U1.5(NC) U2.2(NC) U2.4(NC) U2.5(NC)

### Notes on the sheet
- VDDRES
  [3.0V-3.6V]
- VDD18
  [1.8V-1.98V]
- VDD33
  [3.0V-3.6V]
- Unused
  [do not populate]
- VDDPIX
  [2.3V-3.6V]
- VTREF Supply
  [2.0V-3.6V]
- AXIOM Beta CMV12000
- Over/Under Voltage Check
- 4/5 Voltages
- Copyright (C) 2014-2015 Herbert Poetzl
  Licensed under CERN OHL v.1.2

## Sheet 4 of 4
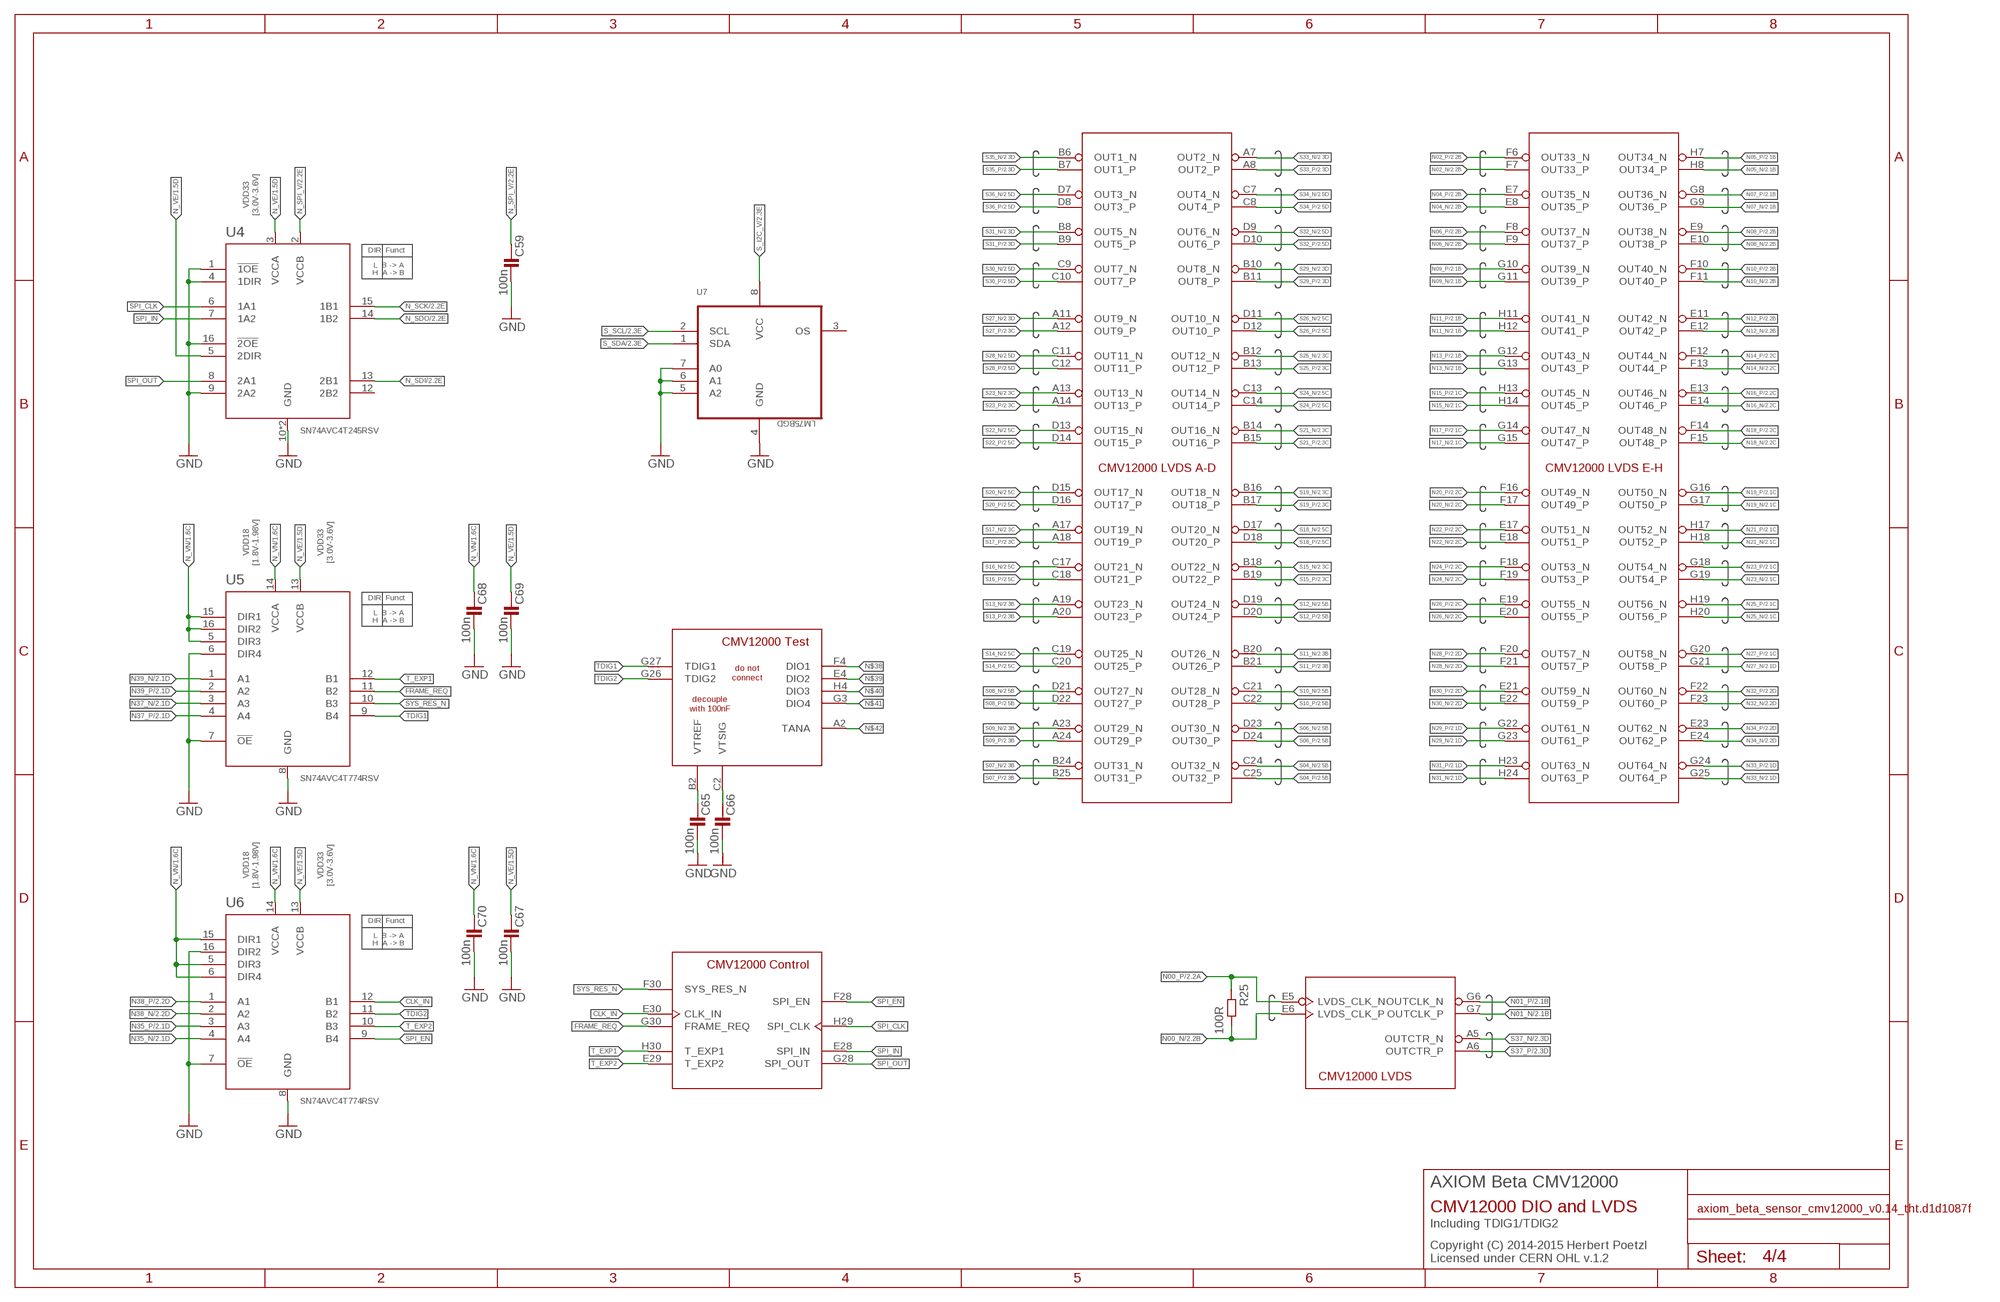
[diagram p3: schematic, sheet 4]

### Parts
C59  100n  C0402-C  [0402-C]
C65  100n  C0402-C  [0402-C]
C66  100n  C0402-C  [0402-C]
C67  100n  C0402-C  [0402-C]
C68  100n  C0402-C  [0402-C]
C69  100n  C0402-C  [0402-C]
C70  100n  C0402-C  [0402-C]
R25  100R  R0402-C  [0402-C]
U4  SN74AVC4T245RSV  [QFN40P185X265X55-16N]
U5  SN74AVC4T774RSV  [QFN40P185X265X55-16N]
U6  SN74AVC4T774RSV  [QFN40P185X265X55-16N]
U7  LM75BGD  [SOT996-2/3]

### Nets
CLK_IN: SENSOR.E30(CLK_IN) U6.12(B1)
FRAME_REQ: SENSOR.G30(FRAME_REQ) U5.11(B2)
GND: C59.2 C65.2 C66.2 C67.2 C68.2 C69.2 C70.2 U4.1(!1OE) U4.4(1DIR) U4.9(2A2) U4.10(GND) U4.11(GND) U4.16(!2OE) U5.6(DIR4) U5.7(!OE) U5.8(GND) U6.7(!OE) U6.8(GND) U6.16(DIR2) U7.4(GND) U7.5(A2) U7.6(A1) U7.7(A0) ; also sheet 1,2,3
N00_N: R25.2 SENSOR.E6(LVDS_CLK_P) ; also sheet 2
N00_P: R25.1 SENSOR.E5(LVDS_CLK_N) ; also sheet 2
N01_N: SENSOR.G7(OUTCLK_P) ; also sheet 2
N01_P: SENSOR.G6(OUTCLK_N) ; also sheet 2
N02_N: SENSOR.F7(OUT33_P) ; also sheet 2
N02_P: SENSOR.F6(OUT33_N) ; also sheet 2
N04_N: SENSOR.E8(OUT35_P) ; also sheet 2
N04_P: SENSOR.E7(OUT35_N) ; also sheet 2
N05_N: SENSOR.H8(OUT34_P) ; also sheet 2
N05_P: SENSOR.H7(OUT34_N) ; also sheet 2
N06_N: SENSOR.F9(OUT37_P) ; also sheet 2
N06_P: SENSOR.F8(OUT37_N) ; also sheet 2
N07_N: SENSOR.G9(OUT36_P) ; also sheet 2
N07_P: SENSOR.G8(OUT36_N) ; also sheet 2
N08_N: SENSOR.E10(OUT38_P) ; also sheet 2
N08_P: SENSOR.E9(OUT38_N) ; also sheet 2
N09_N: SENSOR.G11(OUT39_P) ; also sheet 2
N09_P: SENSOR.G10(OUT39_N) ; also sheet 2
N10_N: SENSOR.F11(OUT40_P) ; also sheet 2
N10_P: SENSOR.F10(OUT40_N) ; also sheet 2
N11_N: SENSOR.H12(OUT41_P) ; also sheet 2
N11_P: SENSOR.H11(OUT41_N) ; also sheet 2
N12_N: SENSOR.E12(OUT42_P) ; also sheet 2
N12_P: SENSOR.E11(OUT42_N) ; also sheet 2
N13_N: SENSOR.G13(OUT43_P) ; also sheet 2
N13_P: SENSOR.G12(OUT43_N) ; also sheet 2
N14_N: SENSOR.F13(OUT44_P) ; also sheet 2
N14_P: SENSOR.F12(OUT44_N) ; also sheet 2
N15_N: SENSOR.H14(OUT45_P) ; also sheet 2
N15_P: SENSOR.H13(OUT45_N) ; also sheet 2
N16_N: SENSOR.E14(OUT46_P) ; also sheet 2
N16_P: SENSOR.E13(OUT46_N) ; also sheet 2
N17_N: SENSOR.G15(OUT47_P) ; also sheet 2
N17_P: SENSOR.G14(OUT47_N) ; also sheet 2
N18_N: SENSOR.F15(OUT48_P) ; also sheet 2
N18_P: SENSOR.F14(OUT48_N) ; also sheet 2
N19_N: SENSOR.G17(OUT50_P) ; also sheet 2
N19_P: SENSOR.G16(OUT50_N) ; also sheet 2
N20_N: SENSOR.F17(OUT49_P) ; also sheet 2
N20_P: SENSOR.F16(OUT49_N) ; also sheet 2
N21_N: SENSOR.H18(OUT52_P) ; also sheet 2
N21_P: SENSOR.H17(OUT52_N) ; also sheet 2
N22_N: SENSOR.E18(OUT51_P) ; also sheet 2
N22_P: SENSOR.E17(OUT51_N) ; also sheet 2
N23_N: SENSOR.G19(OUT54_P) ; also sheet 2
N23_P: SENSOR.G18(OUT54_N) ; also sheet 2
N24_N: SENSOR.F19(OUT53_P) ; also sheet 2
N24_P: SENSOR.F18(OUT53_N) ; also sheet 2
N25_N: SENSOR.H20(OUT56_P) ; also sheet 2
N25_P: SENSOR.H19(OUT56_N) ; also sheet 2
N26_N: SENSOR.E20(OUT55_P) ; also sheet 2
N26_P: SENSOR.E19(OUT55_N) ; also sheet 2
N27_N: SENSOR.G21(OUT58_P) ; also sheet 2
N27_P: SENSOR.G20(OUT58_N) ; also sheet 2
N28_N: SENSOR.F21(OUT57_P) ; also sheet 2
N28_P: SENSOR.F20(OUT57_N) ; also sheet 2
N29_N: SENSOR.G23(OUT61_P) ; also sheet 2
N29_P: SENSOR.G22(OUT61_N) ; also sheet 2
N30_N: SENSOR.E22(OUT59_P) ; also sheet 2
N30_P: SENSOR.E21(OUT59_N) ; also sheet 2
N31_N: SENSOR.H24(OUT63_P) ; also sheet 2
N31_P: SENSOR.H23(OUT63_N) ; also sheet 2
N32_N: SENSOR.F23(OUT60_P) ; also sheet 2
N32_P: SENSOR.F22(OUT60_N) ; also sheet 2
N33_N: SENSOR.G25(OUT64_P) ; also sheet 2
N33_P: SENSOR.G24(OUT64_N) ; also sheet 2
N34_N: SENSOR.E24(OUT62_P) ; also sheet 2
N34_P: SENSOR.E23(OUT62_N) ; also sheet 2
N35_N: U6.4(A4) ; also sheet 2
N35_P: U6.3(A3) ; also sheet 2
N37_N: U5.3(A3) ; also sheet 2
N37_P: U5.4(A4) ; also sheet 2
N38_N: U6.2(A2) ; also sheet 2
N38_P: U6.1(A1) ; also sheet 2
N39_N: U5.1(A1) ; also sheet 2
N39_P: U5.2(A2) ; also sheet 2
N$38: SENSOR.F4(DIO1)
N$39: SENSOR.E4(DIO2)
N$40: SENSOR.H4(DIO3)
N$41: SENSOR.G3(DIO4)
N$42: SENSOR.A2(TANA)
N_SCK: U4.15(1B1) ; also sheet 2
N_SDI: U4.13(2B1) ; also sheet 2
N_SDO: U4.14(1B2) ; also sheet 2
N_SPI_V: C59.1 U4.2(VCCB) ; also sheet 2
N_VE: C67.1 C69.1 U4.3(VCCA) U4.5(2DIR) U5.13(VCCB) U6.13(VCCB) ; also sheet 1,2
N_VN: C68.1 C70.1 U5.5(DIR3) U5.14(VCCA) U5.15(DIR1) U5.16(DIR2) U6.5(DIR3) U6.6(DIR4) U6.14(VCCA) U6.15(DIR1) ; also sheet 1,2
S04_N: SENSOR.C24(OUT32_N) ; also sheet 2
S04_P: SENSOR.C25(OUT32_P) ; also sheet 2
S06_N: SENSOR.D23(OUT30_N) ; also sheet 2
S06_P: SENSOR.D24(OUT30_P) ; also sheet 2
S07_N: SENSOR.B24(OUT31_N) ; also sheet 2
S07_P: SENSOR.B25(OUT31_P) ; also sheet 2
S08_N: SENSOR.D21(OUT27_N) ; also sheet 2
S08_P: SENSOR.D22(OUT27_P) ; also sheet 2
S09_N: SENSOR.A23(OUT29_N) ; also sheet 2
S09_P: SENSOR.A24(OUT29_P) ; also sheet 2
S10_N: SENSOR.C21(OUT28_N) ; also sheet 2
S10_P: SENSOR.C22(OUT28_P) ; also sheet 2
S11_N: SENSOR.B20(OUT26_N) ; also sheet 2
S11_P: SENSOR.B21(OUT26_P) ; also sheet 2
S12_N: SENSOR.D19(OUT24_N) ; also sheet 2
S12_P: SENSOR.D20(OUT24_P) ; also sheet 2
S13_N: SENSOR.A19(OUT23_N) ; also sheet 2
S13_P: SENSOR.A20(OUT23_P) ; also sheet 2
S14_N: SENSOR.C19(OUT25_N) ; also sheet 2
S14_P: SENSOR.C20(OUT25_P) ; also sheet 2
S15_N: SENSOR.B18(OUT22_N) ; also sheet 2
S15_P: SENSOR.B19(OUT22_P) ; also sheet 2
S16_N: SENSOR.C17(OUT21_N) ; also sheet 2
S16_P: SENSOR.C18(OUT21_P) ; also sheet 2
S17_N: SENSOR.A17(OUT19_N) ; also sheet 2
S17_P: SENSOR.A18(OUT19_P) ; also sheet 2
S18_N: SENSOR.D17(OUT20_N) ; also sheet 2
S18_P: SENSOR.D18(OUT20_P) ; also sheet 2
S19_N: SENSOR.B16(OUT18_N) ; also sheet 2
S19_P: SENSOR.B17(OUT18_P) ; also sheet 2
S20_N: SENSOR.D15(OUT17_N) ; also sheet 2
S20_P: SENSOR.D16(OUT17_P) ; also sheet 2
S21_N: SENSOR.B14(OUT16_N) ; also sheet 2
S21_P: SENSOR.B15(OUT16_P) ; also sheet 2
S22_N: SENSOR.D13(OUT15_N) ; also sheet 2
S22_P: SENSOR.D14(OUT15_P) ; also sheet 2
S23_N: SENSOR.A13(OUT13_N) ; also sheet 2
S23_P: SENSOR.A14(OUT13_P) ; also sheet 2
S24_N: SENSOR.C13(OUT14_N) ; also sheet 2
S24_P: SENSOR.C14(OUT14_P) ; also sheet 2
S25_N: SENSOR.B12(OUT12_N) ; also sheet 2
S25_P: SENSOR.B13(OUT12_P) ; also sheet 2
S26_N: SENSOR.D11(OUT10_N) ; also sheet 2
S26_P: SENSOR.D12(OUT10_P) ; also sheet 2
S27_N: SENSOR.A11(OUT9_N) ; also sheet 2
S27_P: SENSOR.A12(OUT9_P) ; also sheet 2
S28_N: SENSOR.C11(OUT11_N) ; also sheet 2
S28_P: SENSOR.C12(OUT11_P) ; also sheet 2
S29_N: SENSOR.B10(OUT8_N) ; also sheet 2
S29_P: SENSOR.B11(OUT8_P) ; also sheet 2
S30_N: SENSOR.C9(OUT7_N) ; also sheet 2
S30_P: SENSOR.C10(OUT7_P) ; also sheet 2
S31_N: SENSOR.B8(OUT5_N) ; also sheet 2
S31_P: SENSOR.B9(OUT5_P) ; also sheet 2
S32_N: SENSOR.D9(OUT6_N) ; also sheet 2
S32_P: SENSOR.D10(OUT6_P) ; also sheet 2
S33_N: SENSOR.A7(OUT2_N) ; also sheet 2
S33_P: SENSOR.A8(OUT2_P) ; also sheet 2
S34_N: SENSOR.C7(OUT4_N) ; also sheet 2
S34_P: SENSOR.C8(OUT4_P) ; also sheet 2
S35_N: SENSOR.B6(OUT1_N) ; also sheet 2
S35_P: SENSOR.B7(OUT1_P) ; also sheet 2
S36_N: SENSOR.D7(OUT3_N) ; also sheet 2
S36_P: SENSOR.D8(OUT3_P) ; also sheet 2
S37_N: SENSOR.A5(OUTCTR_N) ; also sheet 2
S37_P: SENSOR.A6(OUTCTR_P) ; also sheet 2
S_I2C_V: U7.8(VCC) ; also sheet 2
S_SCL: U7.2(SCL) ; also sheet 2
S_SDA: U7.1(SDA) ; also sheet 2
SPI_CLK: SENSOR.H29(SPI_CLK) U4.6(1A1)
SPI_EN: SENSOR.F28(SPI_EN) U6.9(B4)
SPI_IN: SENSOR.E28(SPI_IN) U4.7(1A2)
SPI_OUT: SENSOR.G28(SPI_OUT) U4.8(2A1)
SYS_RES_N: SENSOR.F30(SYS_RES_N) U5.10(B3)
T_EXP1: SENSOR.H30(T_EXP1) U5.12(B1)
T_EXP2: SENSOR.E29(T_EXP2) U6.10(B3)
TDIG1: SENSOR.G27(TDIG1) U5.9(B4)
TDIG2: SENSOR.G26(TDIG2) U6.11(B2)
VTREF: C65.1 SENSOR.B2(VTREF) ; also sheet 1,2
VTSIG: C66.1 SENSOR.C2(VTSIG) ; also sheet 1
Unconnected: U4.12(2B2) U7.3(OS)

### Notes on the sheet
- VDD33
  [3.0V-3.6V]
- DIR  Funct
  
    L  B -> A
    H  A -> B
- VDD18
  [1.8V-1.98V]
- VDD33
  [3.0V-3.6V]
- DIR  Funct
  
    L  B -> A
    H  A -> B
- VDD18
  [1.8V-1.98V]
- VDD33
  [3.0V-3.6V]
- DIR  Funct
  
    L  B -> A
    H  A -> B
- AXIOM Beta CMV12000
- CMV12000 DIO and LVDS
- Including TDIG1/TDIG2
- Copyright (C) 2014-2015 Herbert Poetzl
  Licensed under CERN OHL v.1.2

## Library data of the parts
C1-C92 = generic-rcl:C
GND GND75 GND77 TP1-TP8 = testpad:TP: Test pad
R1 R1X R2 R2X R3-R25 = generic-rcl:R
SENSOR = cmosis:CMV12000
U1 U2 = vref:TLV431DCK
U3 = ldo:MIC47050-ADJ
U4 = lvltrans:SN74AVC4T245: DUAL-SUPPLY BUS TRANSCEIVER
U5 U6 = lvltrans:SN74AVC4T774: 4-BIT DUAL-SUPPLY BUS TRANSCEIVER
U7 = lm75:LM75: Digital temperature sensor and thermal watchdog
UEP = eeprom:BR24G04
UNE UNN UNW USE USS USW = comparator:TS332IQ2T
X-NORTH X-SOUTH = fx10:FX10-144

## Net classes
0 default: width 0.152 mm, drill 0.254 mm
1 power: width 0.152 mm, drill 0.254 mm